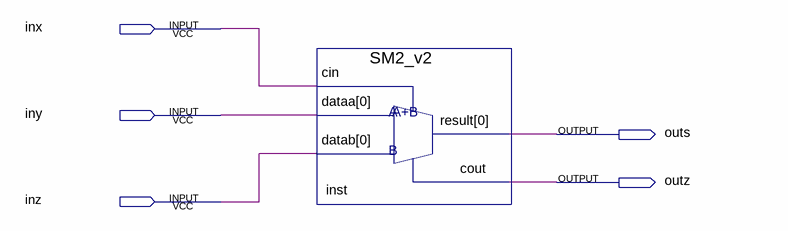
[diagram p0: schematic sheet]
// Quartus schematic Lab2_SM_v2.bdf as structural Verilog: 1 symbols, 5 pins
module Lab2_SM_v2 (
  input  inx,
  input  iny,
  input  inz,
  output outs,
  output outz
);

  SM2_v2 inst (.cin(inx), .dataa(iny), .datab(inz), .result(outs), .cout(outz));
endmodule
